# EAGLE design Qwiic_Accelerometer-MMA8452Q (EAGLE 7.7.0)
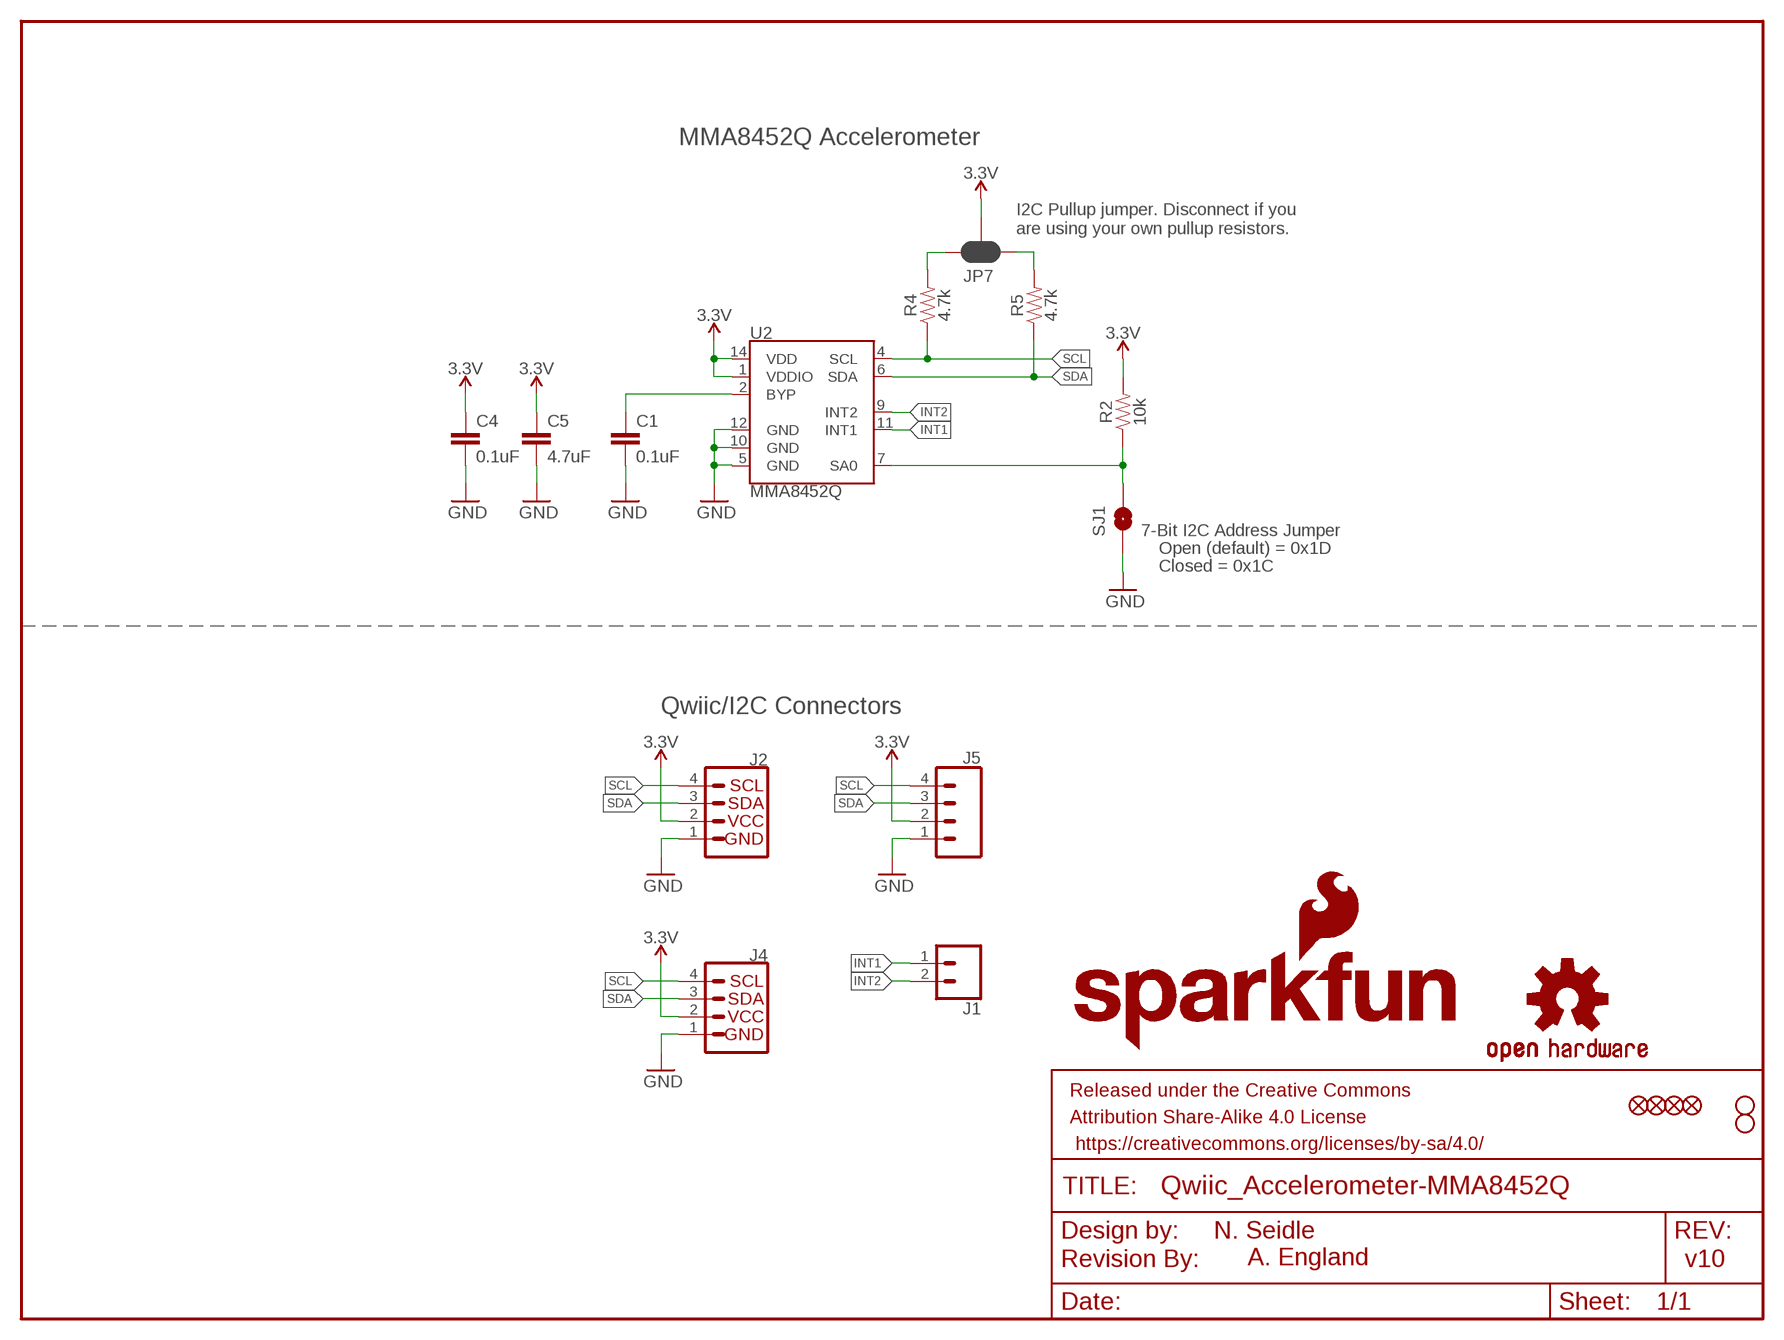
[diagram p0: schematic, sheet 1]

## Parts
C1  0.1uF  0.1UF-0603-25V-(+80/-20%)  [0603]
C4  0.1uF  0.1UF-0603-25V-(+80/-20%)  [0603]
C5  4.7uF  4.7UF0603  [0603]
FRAME1  FRAME-LETTER  [CREATIVE_COMMONS]
J1  CONN_021X02_NO_SILK  [1X02_NO_SILK]
J2  QWIIC_CONNECTORJS-1MM  [1X04_1MM_RA]
J4  QWIIC_CONNECTORJS-1MM  [1X04_1MM_RA]
J5  CONN_041X04_NO_SILK  [1X04_NO_SILK]
JP1  FIDUCIALUFIDUCIAL  [MICRO-FIDUCIAL]
JP2  FIDUCIALUFIDUCIAL  [MICRO-FIDUCIAL]
JP3  STAND-OFF  [STAND-OFF]
JP4  STAND-OFF  [STAND-OFF]
JP5  FIDUCIALUFIDUCIAL  [MICRO-FIDUCIAL]
JP6  FIDUCIALUFIDUCIAL  [MICRO-FIDUCIAL]
JP7  JUMPER-SMT_3_2-NC_PASTE_SILK  [SMT-JUMPER_3_2-NC_PASTE_SILK]
LOGO1  OSHW-LOGOMINI  [OSHW-LOGO-MINI]
LOGO2  SFE_LOGO_NAME_FLAME.1_INCH  [SFE_LOGO_NAME_FLAME_.1]
LOGO3  SFE_LOGO_NAME_FLAME.1_INCH  [SFE_LOGO_NAME_FLAME_.1]
LOGO4  REVISION  [REVISION]
R2  10k  10KOHM-0603-1/10W-1%  [0603]
R4  4.7k  4.7KOHM-0603-1/10W-1%  [0603]
R5  4.7k  4.7KOHM-0603-1/10W-1%  [0603]
SJ1  SOLDERJUMPERNO  [SJ_2S-NO]
U2  MMA8452Q  [QFN-16]

## Nets
3.3V: C4.1 C5.1 J2.2 J4.2 J5.2 JP7.2 R2.2 U2.1(VDDIO) U2.14(VDD)
BYP: C1.1 U2.2(BYP)
GND: C1.2 C4.2 C5.2 J2.1 J4.1 J5.1 SJ1.1 U2.5(GND) U2.10(GND) U2.12(GND)
INT1: J1.1 U2.11(INT1)
INT2: J1.2 U2.9(INT2)
N$1: JP7.1 R5.2
N$2: JP7.3 R4.2
SA0: R2.1 SJ1.2 U2.7(SA0)
SCL: J2.4 J4.4 J5.4 R4.1 U2.4(SCL)
SDA: J2.3 J4.3 J5.3 R5.1 U2.6(SDA)

## Notes on the sheet
- MMA8452Q Accelerometer
- I2C Pullup jumper. Disconnect if you 
  are using your own pullup resistors.
- 7-Bit I2C Address Jumper
- Open (default) = 0x1D
- Closed = 0x1C
- Qwiic/I2C Connectors
- N. Seidle
- A. England | v10

## Library data of the parts
C1 C4 = SparkFun-Capacitors:0.1UF: 0.1µF ceramic capacitors A capacitor is a passive two-terminal electrical component used to store electrical energy temporarily in an electric field.; PROD_ID: CAP-00810
C5 = SparkFun-Capacitors:4.7UF: 4.7µF ceramic capacitors A capacitor is a passive two-terminal electrical component used to store electrical energy temporarily in an electric field.; PROD_ID: CAP-08280
FRAME1 = SparkFun-Aesthetics:FRAME-LETTER: Schematic Frame - Letter Standard 8.5x11 US Letter frame
J1 = SparkFun-Connectors:CONN_02: Multi connection point. Often used as Generic Header-pin footprint for 0.1 inch spaced/style header connections On any of the 0.1 inch spaced packages, you can populate with these: Break Away Headers - Straight <https://www.sparkfun.com/products/116> (PRT-00116) Break Away Male Headers - Right Angle <https://www.sparkfun.com/products/553> (PRT-00553) Female Headers <https://www.sparkfun.com/products/115> (PRT-00115) Break Away Headers - Machine Pin <https://www.sparkfun.com/products/117> (PRT-00117) Break Away Female Headers - Swiss Machine Pin <https://www.sparkfun.com/products/743> (PRT-00743) For SCREWTERMINALS and SPRING TERMINALS visit here: Screw Terimnals on SparkFun.com <https://www.sparkfun.com/search/results?term=Screw+Terminals> (5mm/3.5mm/2.54mm spacing) This device is also useful as a general connection point to wire up your design to another part of your project. Our various solder wires solder well into these plated through hole pads. Hook-Up Wire - Assortment (Stranded, 22 AWG) <https://www.sparkfun.com/products/11375> (PRT-11375) Hook-Up Wire - Assortment (Solid Core, 22 AWG) <https://www.sparkfun.com/products/11367> (PRT-11367) View the entire wire category on our website here <https://www.sparkfun.com/categories/141> Special notes: Molex polarized connector foot print use with: PRT-08233 with associated crimp pins and housings. 2.54_SCREWTERM for use with PRT-10571. 3.5mm Screw Terminal footprints for PRT-08084 5mm Screw Terminal footprints for use with PRT-08432
J2 J4 = SparkFun-Connectors:QWIIC_CONNECTOR: SparkFun I2C Standard Qwiic Connector An SMD 1mm pitch JST connector makes it easy and quick (get it? Qwiic?) to connect I2C devices to each other. The Qwiic system <http://www.sparkfun.com/qwiic> enables fast and solderless connection between popular platforms and various sensors and actuators. We carry 200mm <https://www.sparkfun.com/products/14204>, 100mm <https://www.sparkfun.com/products/14205>, 50mm <https://www.sparkfun.com/products/14206>, and breadboard friendly <https://www.sparkfun.com/products/14207> Qwiic cables. We also offer 10 pcs strips <https://www.sparkfun.com/products/14323> the SMD connectors.; PROD_ID: CONN-13694
J5 = SparkFun-Connectors:CONN_04: Multi connection point. Often used as Generic Header-pin footprint for 0.1 inch spaced/style header connections On any of the 0.1 inch spaced packages, you can populate with these: Break Away Headers - Straight <https://www.sparkfun.com/products/116> (PRT-00116) Break Away Male Headers - Right Angle <https://www.sparkfun.com/products/553> (PRT-00553) Female Headers <https://www.sparkfun.com/products/115> (PRT-00115) Break Away Headers - Machine Pin <https://www.sparkfun.com/products/117> (PRT-00117) Break Away Female Headers - Swiss Machine Pin <https://www.sparkfun.com/products/743> (PRT-00743) For SCREWTERMINALS and SPRING TERMINALS visit here: Screw Terimnals on SparkFun.com <https://www.sparkfun.com/search/results?term=Screw+Terminals> (5mm/3.5mm/2.54mm spacing) This device is also useful as a general connection point to wire up your design to another part of your project. Our various solder wires solder well into these plated through hole pads. Hook-Up Wire - Assortment (Stranded, 22 AWG) <https://www.sparkfun.com/products/11375> (PRT-11375) Hook-Up Wire - Assortment (Solid Core, 22 AWG) <https://www.sparkfun.com/products/11367> (PRT-11367) View the entire wire category on our website here <https://www.sparkfun.com/categories/141> Special notes: Molex polarized connector foot print use with SKU : PRT-08231 with associated crimp pins and housings. 1MM SMD Version SKU: PRT-10208; PROD_ID: CONN-09696
JP1 JP2 JP5 JP6 = SparkFun:FIDUCIAL: Fiducial Alignment Points Various fiducial points for machine vision alignment.
JP3 JP4 = SparkFun:STAND-OFF: Stand Off This is the mechanical footprint for a #4 phillips button head screw. Use the keepout ring to avoid running the screw head into surrounding components. SKU : PRT-00447
JP7 = SparkFun-Jumpers:JUMPER-SMT_3_2-NC_PASTE: Normally closed solder jumper (2 of 2 connections) This jumper has an aperture in the stencil to allow solder paste to bridge both connections. Both connections are normally closed (NC). Wick off the solder to open the connection(s). Reapply solder to reclose the connection(s).
LOGO1 = SparkFun-Aesthetics:OSHW-LOGO: Open-Source Hardware (OSHW) Logo This logo indicates the piece of hardware it is found on incorporates a OSHW license and/or adheres to the definition of open source hardware found here: http://freedomdefined.org/OSHW
LOGO2 LOGO3 = SparkFun-Aesthetics:SFE_LOGO_NAME_FLAME: SparkFun Font Logo w/ Flame This is the SparkFun full logo. The logo on the schematic will always be the same size; the package variant is the height of the flame part of the logo. Default layer for the logo on the board is tSilk.
LOGO4 = SparkFun-Aesthetics:REVISION: "Revision By" Text Preceding text for revisor documentation. Includes schematic text on "symbols" layer, and board text on tDoc.
R2 = SparkFun-Resistors:10KOHM: 10kΩ resistor A resistor is a passive two-terminal electrical component that implements electrical resistance as a circuit element. Resistors act to reduce current flow, and, at the same time, act to lower voltage levels within circuits. - Wikipedia; PROD_ID: RES-00824
R4 R5 = SparkFun-Resistors:4.7KOHM: 4.7kΩ resistor A resistor is a passive two-terminal electrical component that implements electrical resistance as a circuit element. Resistors act to reduce current flow, and, at the same time, act to lower voltage levels within circuits. - Wikipedia; PROD_ID: RES-07857
SJ1 = SparkFun:SOLDERJUMPER: Solder Jumper Standard SMD solder jumper. Used to automate production. Two varients : Normally Open and Normally Closed are the same, but have different paste layers. NC will have a large amount of paste and should jumper during reflow.
U2 = SparkFun-Sensors:MMA8452Q: NXP MMA8452Q 3-Axis Digital Accelerometer The MMA8452Q is a smart low-power, three-axis, capacitive MEMS accelerometer with 12 bits of resolution. This accelerometer is packed with embedded functions with flexible user programmable options, configurable to two interrupt pins. Supply Voltage: 1.6-3.6V Range: +/- 2g, 4g, 8g Interface: I2C, 12-bit and 8-bit ODR: 1.56 Hz - 800 Hz Package: QFN-16 Datasheet <http://cache.freescale.com/files/sensors/doc/data_sheet/MMA8452Q.pdf> SparkFun Products SparkFun Triple Axis Accelerometer Breakout - MMA8452Q <https://www.sparkfun.com/products/12756> (SEN-12756) SparkFun RedBot Sensor - Accelerometer <https://www.sparkfun.com/products/12589> (SEN-12589); PROD_ID: IC-10769

## Board
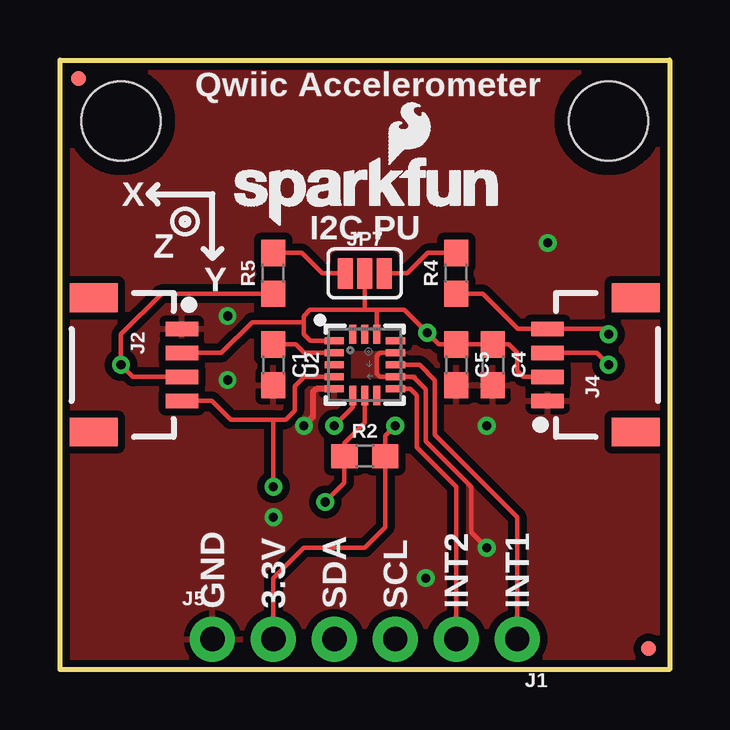
[diagram p1: board, top side]
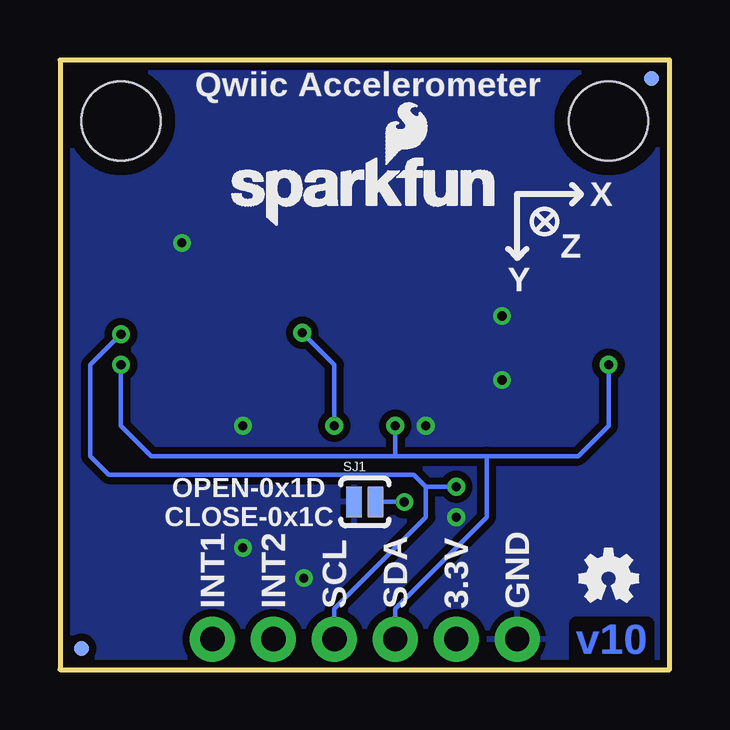
[diagram p2: board, bottom side, seen from below]

Size 25.4 x 25.4 mm. Coordinates in mm from the lower left corner, seen from the top.
Outline: 0,0 0,25.4 25.4,25.4 25.4,0 0,0
Copper layers (1*16): Top 0.035mm / dielectric 1.5mm / Bottom 0.035mm
Design rules "SparkFun-2-layer-TIGHT": minimum track width 7mil, minimum drill 15mil, track to track 7mil, track to pad 7mil, pad to pad 7mil, via to via 7mil, smd to smd 7mil, copper to edge 7mil, drill to drill 7mil, minimum pad ring 7mil, minimum via ring 7mil, stop-mask expansion 4mil, vias tented up to drill 25mil, thermal gap 10mil

### Footprints (pad centres in the part's own frame; a part is rotated, then mirrored left to right if it is on the bottom)
0603 = smd 1.1 x 1: 1 -0.85,0; 2 0.85,0
1X02_NO_SILK = drill 1.016 pad 1.88: 1 0,0; 2 2.54,0
1X04_1MM_RA = smd 0.6 x 1.35: 1 -1.5,0; 2 -0.5,0; 3 0.5,0; 4 1.5,0 | smd 1.2 x 2: NC1 2.8,-3.675; NC2 -2.8,-3.675
1X04_NO_SILK = drill 1.016 pad 1.88: 1 0,0; 2 2.54,0; 3 5.08,0; 4 7.62,0
MICRO-FIDUCIAL = smd 0.635 x 0.635: 1 0,0
STAND-OFF = hole 3.302: 0,0
SMT-JUMPER_3_2-NC_PASTE_SILK = smd 0.635 x 1.27: 1 -0.813,0; 2 0,0; 3 0.813,0
SJ_2S-NO = smd 0.635 x 1.27: 1 -0.45,0; 2 0.45,0
QFN-16 = smd 0.8 x 0.3: 1 -1.275,1; 2 -1.275,0.5; 3 -1.275,0; 4 -1.275,-0.5; 5 -1.275,-1; 9 1.275,-1; 10 1.275,-0.5; 11 1.275,0; 12 1.275,0.5; 13 1.275,1 | smd 0.3 x 0.8: 6 -0.5,-1.275; 7 0,-1.275; 8 0.5,-1.275; 14 0.5,1.275; 15 0,1.275; 16 -0.5,1.275

### Placement (x,y rotation side)
C1  8.89,12.7 270 top
C4  18.03,12.7 270 top
C5  16.51,12.7 270 top
FRAME1  -15.24,-7.62 0 top  (outside the outline)
J1  19.05,1.27 180 top
J2  5.08,12.7 270 top
J4  20.32,12.7 90 top
J5  6.35,1.27 0 top
JP1  24.51,0.89 0 bottom
JP2  24.51,0.89 0 top
JP3  2.54,22.86 0 top
JP4  22.86,22.86 0 top
JP5  0.76,24.64 0 bottom
JP6  0.76,24.64 0 top
JP7  12.7,16.51 0 top
LOGO1  2.54,3.81 0 bottom
LOGO2  6.86,18.41 0 top
LOGO3  18.67,18.41 0 bottom
LOGO4  -3.81,-10.16 0 top  (outside the outline)
R2  12.7,8.89 0 top
R4  16.51,16.51 90 top
R5  8.89,16.51 90 top
SJ1  12.7,6.99 0 bottom
U2  12.7,12.7 0 top

### Tracks (layer width: path | path; a pad name or v marks a point on that pad's centre or on a via)
3.3V  (via drill 0.38)
  Top 0.178: J4.2 19.3,12.2 19.05,12.45 19.05,13.21 18.71,13.55 C4.1 C5.1 15.79,13.55 v15.3,14.03 14.35,14.99 13.21,14.99 | J2.2 6.72,13.2 8,14.48 10.16,14.48 | U2.1 10.43,13.7 10.16,13.97 10.16,14.48 | 10.16,14.48 10.16,14.73 10.41,14.99 12.7,14.99 | v13.97,10.16 13.55,9.74 R2.2 13.55,5.93 12.7,5.08 10.16,5.08 8.89,3.81 J5.2 | 13.21,14.99 12.7,14.99 | U2.14 13.2,14.98 13.21,14.99 | JP7.2 12.7,14.99
  Bottom 0.178: v13.97,10.16 13.97,12.7 v15.3,14.03
BYP
  Top 0.178: U2.2 10.17,13.2 9.82,13.55 C1.1
GND  (via drill 0.38)
  Top 0.178: v17.78,5.08 17.14,5.71 17.14,7.62 15.24,9.53 15.24,11.68 14.72,12.2 U2.10 13.33,12.2 13.21,12.32 13.21,13.08 13.33,13.2 U2.12 14.12,13.2
  Top 0.254: U2.5 10.68,11.7 10.54,11.56 10.54,10.54 v10.16,10.16
  other vias: 6.99,12.06 6.99,14.73 17.78,10.16 20.32,17.78 15.24,3.81 8.89,6.35
  pour Bottom (isolate 0.305): 0,0 0,25.4 25.4,25.4 25.4,0
  pour Top (isolate 0.305): 0,0 0,25.4 25.4,25.4 25.4,0
INT1
  Top 0.178: U2.11 14.99,12.7 15.62,12.06 15.62,9.78 19.05,6.35 J1.1
INT2
  Top 0.178: U2.9 14.59,11.7 14.86,11.43 14.86,9.27 16.51,7.62 J1.2
N$1
  Top 0.178: JP7.1 10.92,16.51 10.07,17.36 R5.2
N$2
  Top 0.178: JP7.3 14.48,16.51 15.33,17.36 R4.2
SA0  (via drill 0.38)
  Top 0.178: U2.7 12.7,10.29 11.85,9.44 R2.1 11.85,7.79 v11.05,6.99
  Bottom 0.178: SJ1.2 v11.05,6.99
SCL  (via drill 0.38)
  Top 0.178: R4.1 17.61,15.66 19.07,14.2 J4.4 22.63,14.2 v22.86,13.97 | U2.4 10.17,12.2 9.78,11.81 9.78,10.79 9.4,10.41 8.89,10.41 | 8.89,10.41 7.11,10.41 6.33,11.2 J2.4 | 8.89,10.41 v8.89,7.62
  Bottom 0.178: v22.86,13.97 24.13,12.7 24.13,8.89 23.37,8.13 10.67,8.13 10.16,7.62 | 10.16,7.62 v8.89,7.62 | 10.16,7.62 10.16,6.35 13.97,2.54 J5.4
SDA  (via drill 0.38)
  Top 0.178: U2.6 12.2,10.93 v11.43,10.16 | J4.3 22.36,13.2 v22.86,12.7 | J2.3 3.04,12.2 v2.54,12.7 2.54,13.97 4.23,15.66 R5.1
  Bottom 0.178: v22.86,12.7 22.86,10.16 21.59,8.89 11.43,8.89 | 11.43,8.89 7.62,8.89 | 7.62,8.89 3.81,8.89 2.54,10.16 v2.54,12.7 | 7.62,8.89 7.62,6.35 11.43,2.54 J5.3 | v11.43,10.16 11.43,8.89

### Text on the board
Bottom: v10
tPlace: Qwiic Accelerometer | X | Z | I2C PU | Y | GND | 3.3V | SDA | SCL | INT2 | INT1
bPlace: Qwiic Accelerometer | X | Z | Y | OPEN-0x1D / CLOSE-0x1C | GND | 3.3V | SDA | SCL | INT2 | INT1
tDocu: N. Seidle | A. England